# Altium schematic sheet decoupling.SchDoc
size A
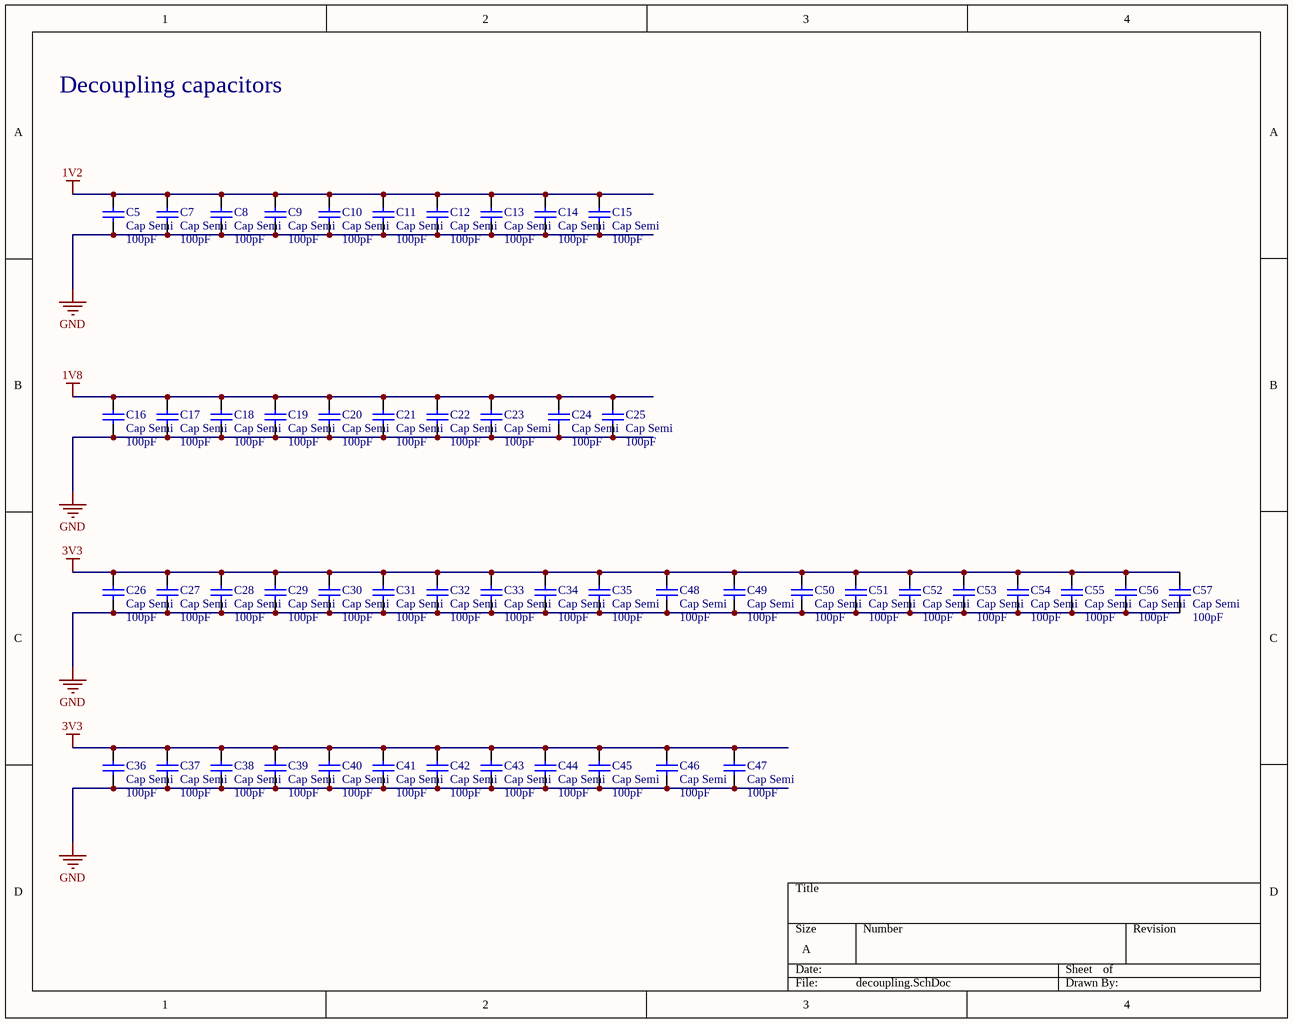
[diagram p0: decoupling.SchDoc]

## Parts
C5  Cap Semi  value 100pF  [C1206]
C7  Cap Semi  value 100pF  [C1206]
C8  Cap Semi  value 100pF  [C1206]
C9  Cap Semi  value 100pF  [C1206]
C10  Cap Semi  value 100pF  [C1206]
C11  Cap Semi  value 100pF  [C1206]
C12  Cap Semi  value 100pF  [C1206]
C13  Cap Semi  value 100pF  [C1206]
C14  Cap Semi  value 100pF  [C1206]
C15  Cap Semi  value 100pF  [C1206]
C16  Cap Semi  value 100pF  [C1206]
C17  Cap Semi  value 100pF  [C1206]
C18  Cap Semi  value 100pF  [C1206]
C19  Cap Semi  value 100pF  [C1206]
C20  Cap Semi  value 100pF  [C1206]
C21  Cap Semi  value 100pF  [C1206]
C22  Cap Semi  value 100pF  [C1206]
C23  Cap Semi  value 100pF  [C1206]
C24  Cap Semi  value 100pF  [C1206]
C25  Cap Semi  value 100pF  [C1206]
C26  Cap Semi  value 100pF  [C1206]
C27  Cap Semi  value 100pF  [C1206]
C28  Cap Semi  value 100pF  [C1206]
C29  Cap Semi  value 100pF  [C1206]
C30  Cap Semi  value 100pF  [C1206]
C31  Cap Semi  value 100pF  [C1206]
C32  Cap Semi  value 100pF  [C1206]
C33  Cap Semi  value 100pF  [C1206]
C34  Cap Semi  value 100pF  [C1206]
C35  Cap Semi  value 100pF  [C1206]
C36  Cap Semi  value 100pF  [C1206]
C37  Cap Semi  value 100pF  [C1206]
C38  Cap Semi  value 100pF  [C1206]
C39  Cap Semi  value 100pF  [C1206]
C40  Cap Semi  value 100pF  [C1206]
C41  Cap Semi  value 100pF  [C1206]
C42  Cap Semi  value 100pF  [C1206]
C43  Cap Semi  value 100pF  [C1206]
C44  Cap Semi  value 100pF  [C1206]
C45  Cap Semi  value 100pF  [C1206]
C46  Cap Semi  value 100pF  [C1206]
C47  Cap Semi  value 100pF  [C1206]
C48  Cap Semi  value 100pF  [C1206]
C49  Cap Semi  value 100pF  [C1206]
C50  Cap Semi  value 100pF  [C1206]
C51  Cap Semi  value 100pF  [C1206]
C52  Cap Semi  value 100pF  [C1206]
C53  Cap Semi  value 100pF  [C1206]
C54  Cap Semi  value 100pF  [C1206]
C55  Cap Semi  value 100pF  [C1206]
C56  Cap Semi  value 100pF  [C1206]
C57  Cap Semi  value 100pF  [C1206]

## Nets
1V2: C5.2 C7.2 C8.2 C9.2 C10.2 C11.2 C12.2 C13.2 C14.2 C15.2
1V8: C16.2 C17.2 C18.2 C19.2 C20.2 C21.2 C22.2 C23.2 C24.2 C25.2
3V3: C26.2 C27.2 C28.2 C29.2 C30.2 C31.2 C32.2 C33.2 C34.2 C35.2 C36.2 C37.2 C38.2 C39.2 C40.2 C41.2 C42.2 C43.2 C44.2 C45.2 C46.2 C47.2 C48.1 C49.2 C50.2 C51.2 C52.2 C53.2 C54.2 C55.2 C56.2 C57.2
GND: C5.1 C7.1 C8.1 C9.1 C10.1 C11.1 C12.1 C13.1 C14.1 C15.1 C16.1 C17.1 C18.1 C19.1 C20.1 C21.1 C22.1 C23.1 C24.1 C25.1 C26.1 C27.1 C28.1 C29.1 C30.1 C31.1 C32.1 C33.1 C34.1 C35.1 C36.1 C37.1 C38.1 C39.1 C40.1 C41.1 C42.1 C43.1 C44.1 C45.1 C46.1 C47.1 C48.2 C49.1 C50.1 C51.1 C52.1 C53.1 C54.1 C55.1 C56.1 C57.1

## Notes on the sheet
- Decoupling capacitors

## Library data of the parts
C5 C7-C57 = Cap Semi: Capacitor (Semiconductor SIM Model); Published: 8-Jun-2000; LatestRevisionDate: 29-May-2009; LatestRevisionNote: IPC-7351 Footprint Added.; PackageReference: C1206; Publisher: Altium Limited; PackageDescription: Chip Capacitor